# Altium schematic sheet USB_CHARGE.SchDoc
size 386 x 233 mm
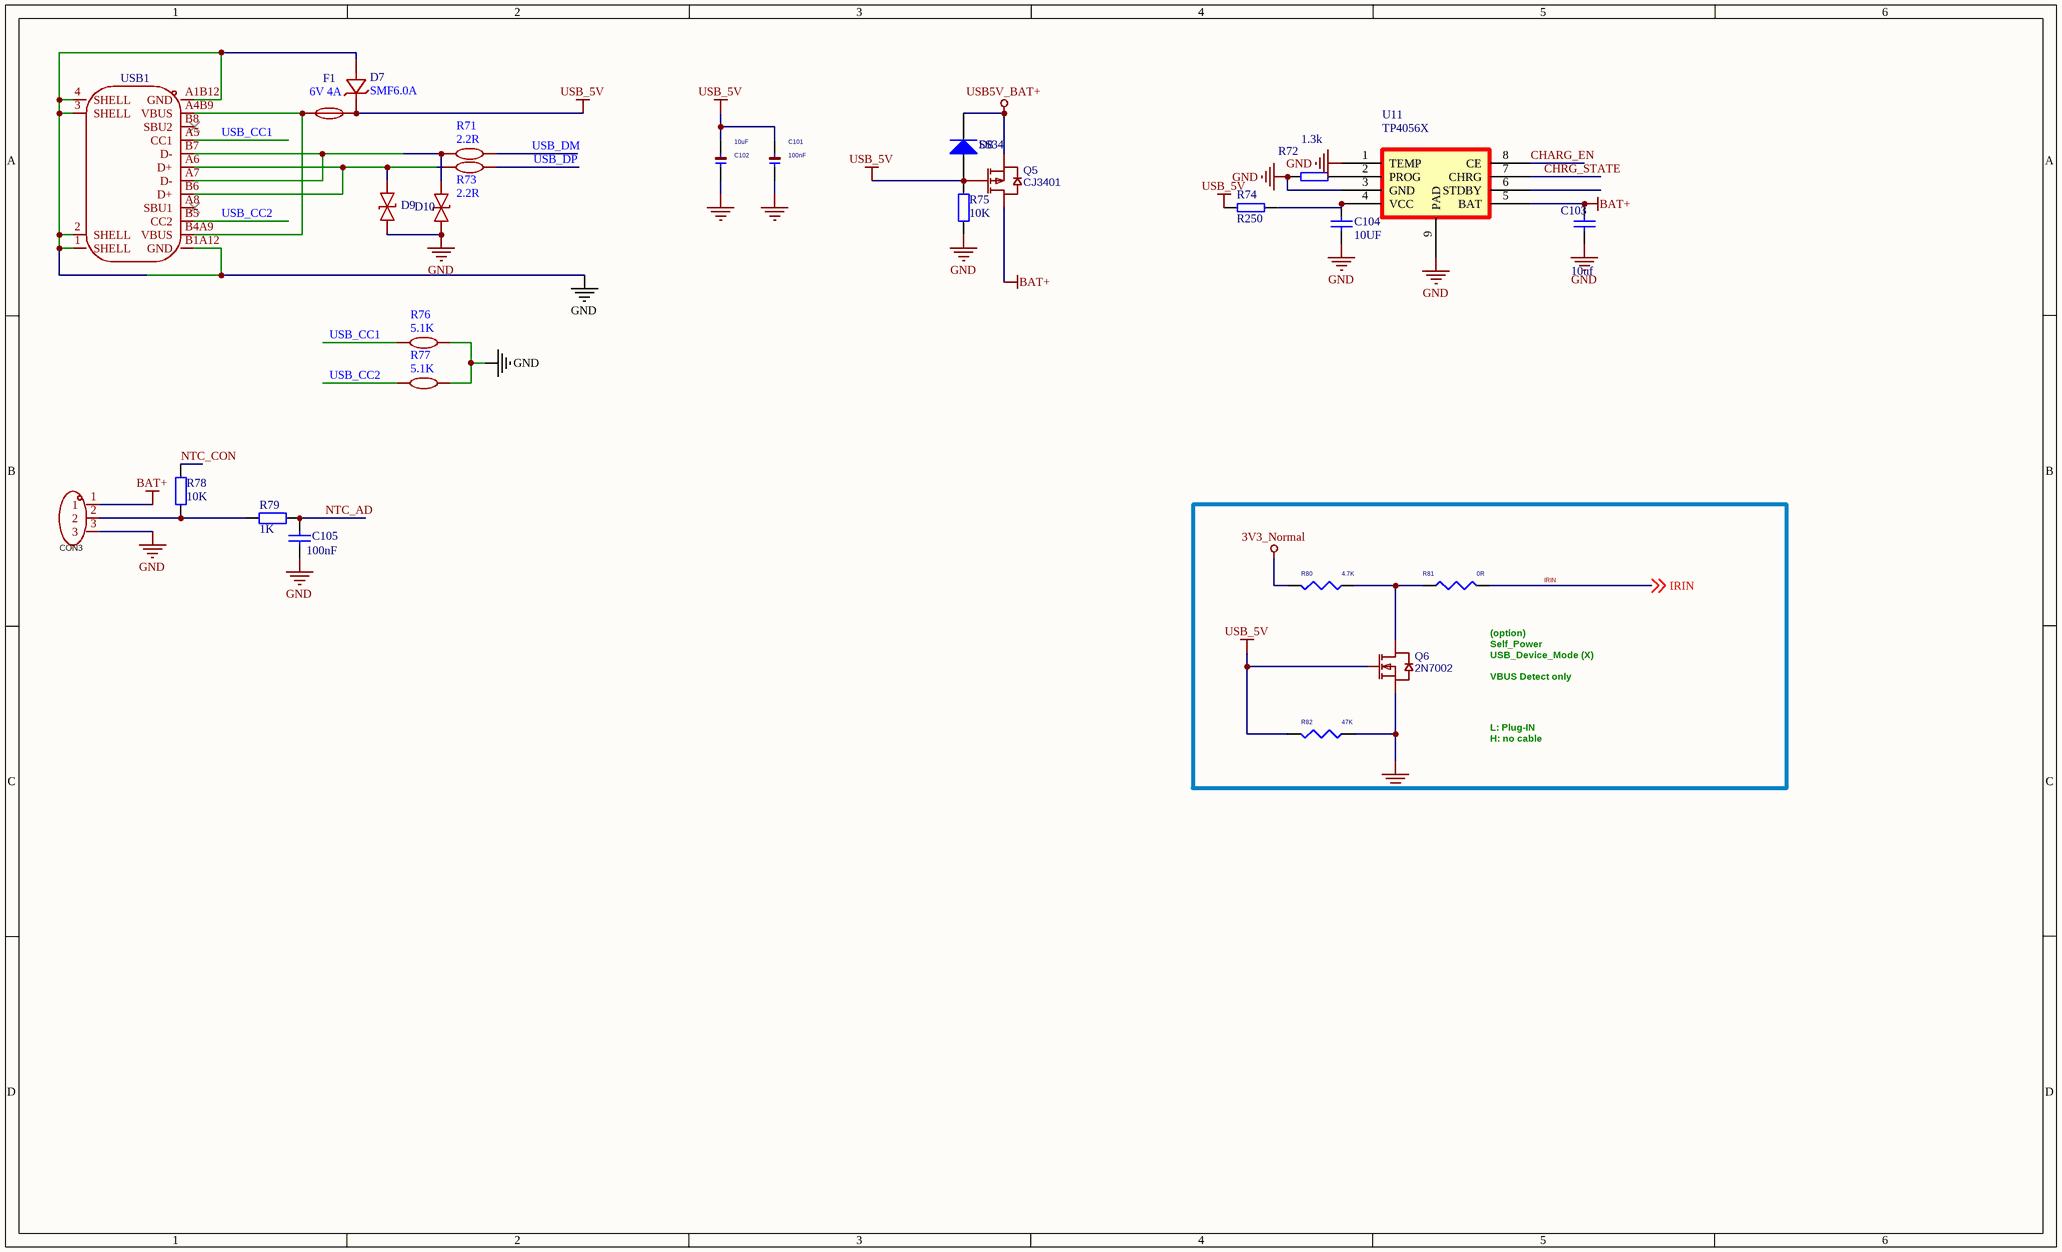
[diagram p0: USB_CHARGE.SchDoc]

## Parts
C101  100nF  [C0402]
C102  10uF  [C0402]
C103  10uf  [0603_C]
C104  10UF  [0603_c]
C105  100nF  [0603_C]
CON3  BX-PH2.0-3PZZ  [CONN-SMD_2.0-3PLT]  (value not drawn)
D7  SMF6.0A  [SOD-123]
D8  SS34  [SMA]
D9  LESD5Z5.0CT1G  [SOD-523_L1.2-W0.8-LS1.6-BI]  (value not drawn)
D10  LESD5Z5.0CT1G  [SOD-523_L1.2-W0.8-LS1.6-BI]  (value not drawn)
F1  6V 4A  [F1210]
Q5  CJ3401  [SOT-23]
Q6  2N7002  [SOT-23]
R71  2.2R  [R0603]
R72  1.3k  [0603_R]
R73  2.2R  [R0603]
R74  R250  [1206_R]
R75  10K  [0603_R]
R76  5.1K  [R0603]
R77  5.1K  [R0603]
R78  10K  [0603_R]
R79  1K  [0603_R]
R80  4.7K  [R0402]
R81  0R  [R0402]
R82  47K  [R0402]
U11  TP4056X  [SOP8-9]
USB1  HC-TYPE-C-16P-01A  [USB-C-SMD_HC-TYPE-C-16P-01A]  (value not drawn)

## Nets
3V3_Normal: R80.1
BAT+: C103.1 CON3.1 Q5.3(D) U11.5(BAT)
GND: C101.2 C102.2 C103.2 C104.1 C105.1 CON3.3 D7.2(A) D9.1 D10.1 Q6.2(S) R72.1 R75.1 R76.2 R77.2 R82.2 U11.1(TEMP) U11.3(GND) U11.9(PAD) USB1.1(SHELL) USB1.2(SHELL) USB1.3(SHELL) USB1.4(SHELL) USB1.A1B12(GND) USB1.B1A12(GND)
USB5V_BAT+: D8.2(K) Q5.2(S)
USB_5V: C101.1 C102.1 D7.1(K) D8.1(A) F1.2 Q5.1(G) Q6.1(G) R74.2 R75.2 R82.1
CHARG_EN: U11.8(CE)
CHRG_STATE: U11.7(CHRG)
IRIN: R81.1 ; off-sheet IRIN
NTC_AD: C105.2 R79.2
NTC_CON: R78.1
USB_CC1: R76.1 USB1.A5(CC1)
USB_CC2: R77.1 USB1.B5(CC2)
USB_DM: R71.2
USB_DP: R73.2
NetC104_2: C104.2 R74.1 U11.4(VCC)
NetCON3_2: CON3.2 R78.2 R79.1
NetD9_2: D9.2 R73.1 USB1.A6(D+) USB1.B6(D+)
NetD10_2: D10.2 R71.1 USB1.A7(D-) USB1.B7(D-)
NetF1_1: F1.1 USB1.A4B9(VBUS) USB1.B4A9(VBUS)
NetQ6_3: Q6.3(D) R80.2 R81.2
NetR72_2: R72.2 U11.2(PROG)

Not connected (* = marked no-connect by the designer): U11 6(STDBY); USB1 A8(SBU1)* B8(SBU2)*

## Notes on the sheet
- (near R81) (option)
  Self_Power
  USB_Device_Mode (X)
  VBUS Detect only
- L: Plug-IN
  H: no cable

## Library data of the parts
C101 = C0402/100nF/10V/X7R: [ 100nF(0.1uF),10V,X7R ](0402); Part Name: 0402B104K100C; Brand: Walsin地穝; Class: Capacitor; Creator: Alan.Liu#6135/0920796617
C102 = C0402: Class: DISCRETE
C103 = Cap: Capacitor; Value: 10nF; Published: 8-Jun-2000; Revision: July-2002: Re-released for DXP Platform.; Publisher: Altium Limited
C104 C105 = CAP
CON3 = BX-PH2.0-3PZZ: Add into BOM: yes; Pins Structure: 1x3P; Pitch: 2mm; Reference Series: PH; Number of PINs Per Row: 3; Current Rating (Max): 2A; Symbol: BX-PH2.0-3PZZ; Device: BX-PH2.0-3PZZ; LCSC Part Name: BX-PH2.0-3PZZ; Supplier Part: C18077745; Manufacturer Part: BX-PH2.0-3PZZ; JLCPCB Part Class: Extended Part; Datasheet: https://atta.szlcsc.com/upload/public/pdf/source/20231017/78B49E88B01779D5C268ECAB29020769.pdf; Supplier: LCSC; Convert to PCB: yes; Number of Pins: 3P; Number of Rows: 1; Row Spacing: -; Comment_1: BX-PH2.0-3PZZ
D7 = SMF6.0A_C19077499: Add into BOM: yes; Reverse Stand-Off Voltage (Vrwm): 6V; Maximum Clamping Voltage: 10.3V; Peak Pulse Current (Ipp)@10/1000us: 19.4A; Peak Pulse Power Dissipation (Ppp)@10/1000us: 200W; Breakdown Voltage: 6.67V; Reverse Leakage Current (Ir): 400uA; Type: TVS; Symbol: SMF6.0A_C19077499; Device: SMF6.0A_C19077499; Supplier: LCSC; Supplier Part: C19077499; Manufacturer Part: SMF6.0A; LCSC Part Name: SMF6.0A; Supplier Footprint: SOD-123FL; JLCPCB Part Class: Extended Part; Datasheet: https://atta.szlcsc.com/upload/public/pdf/source/20231201/BA209EB353689BD2A9785188AB9E10B0.pdf; Convert to PCB: yes
D8 = Diode 1N4148: High Conductance Fast Diode; Published: 8-Jun-2000; LatestRevisionDate: 17-Jul-2002; LatestRevisionNote: Re-released for DXP Platform.; DatasheetVersion: 1997; PackageReference: DO-35; Publisher: Altium Limited; PackageDescription: Diode, Axial; Body 3.8 x 1.9 mm (LxDia. max), Lead Dia. 0.53 mm (max); Code_JEDEC: DO-204-AH; ComponentLink1Description: Manufacturer Link; ComponentLink1URL: http://www.fairchildsemi.com/; ComponentLink2Description: Datasheet; ComponentLink2URL: http://www.fairchildsemi.com/ds/1N%2F1N4148.pdf
D9 D10 = LESD5Z5.0CT1G: Add into BOM: yes; Reverse Stand-Off Voltage (Vrwm): 5V; Maximum Clamping Voltage: 18.6V; Peak Pulse Current (Ipp)@10/1000us: 9.4A; Breakdown Voltage: 5.6V; Type: ESD; Symbol: LESD5Z5.0CT1G; Device: LESD5Z5.0CT1G; Supplier: LCSC; Manufacturer Part: LESD5Z5.0CT1G; Supplier Part: C136167; Supplier Footprint: SOD-523; Datasheet: https://atta.szlcsc.com/upload/public/pdf/source/20171026/C136167_15089841930291059137.pdf; Convert to PCB: yes
F1 = SMD1210B150TFT: Manufacturer Part: 6V   2A; Add into BOM: yes; Current Rating (Max): 100A; Hold Current: 1.5A; Trip Current: 3A; Power Dissipation: 800mW; Maximum Time to Trip: 300ms; Symbol: SMD1210B150TFT; Device: SMD1210B150TFT; Supplier Part: C269165; Supplier Footprint: 1210; Datasheet: https://atta.szlcsc.com/upload/public/pdf/source/20190124/C269169_A54EAE2455D8E3AD9881401F59298F09.pdf; Supplier: LCSC; Convert to PCB: yes; Operating Voltage (Max): 6V
Q5 = CJ3401: BOM_Manufacturer: CJ; BOM_Supplier: LCSC; BOM_Manufacturer Part: CJ3401; BOM_Supplier Part: C13799; BOM_JLCPCB Part Class: Extended Part; spicePre: Q; spiceSymbolName: CJ3401
Q6 = JMTL3400A: Contributor: LCSC; BOM_Supplier: LCSC; BOM_Supplier Part: C2890442; BOM_Manufacturer Part: JMTL3400A; BOM_JLCPCB Part Class: Extended Part; spicePre: Q; spiceSymbolName: JMTL3400A
R71 R73 R76 R77 = Res_0603: Convert to PCB: yes; Device: Res_0603; Add into BOM: yes; Supplier Footprint: 0603
  R71 R73: Value: 2.2R
  R76 R77: Value: 5.1K
R72 R74 = RES
R75 = Res2: Resistor; Value: 120R; Published: 8-Jun-2000; LatestRevisionDate: 17-Jul-2002; LatestRevisionNote: Re-released for DXP Platform.; PackageReference: AXIAL-0.4; Publisher: Altium Limited
R78 R79 = Res1: 贴片电阻
R80 R82 = R_Dup2
R81 = R_Dup1
U11 = TP4056
USB1 = HC-TYPE-C-16P-01A: Add into BOM: yes; Connector Type: Type-C; Number of Contacts: 16P; Number of Ports: 1; Current Rating - Power (Max): 5A; Symbol: HC-TYPE-C-16P-01A; Device: HC-TYPE-C-16P-01A; Supplier Part: C2894897; Manufacturer Part: HC-TYPE-C-16P-01A; Supplier Footprint: SMD; Datasheet: https://atta.szlcsc.com/upload/public/pdf/source/20221116/CF1C0058359F0761D6F7BB69303000BD.pdf; Supplier: LCSC; Convert to PCB: yes; Standard: -